# Altium schematic sheet USBSerial.SchDoc: USB Serial interface
size A4; SheetNumber: 7; SheetTotal: 7
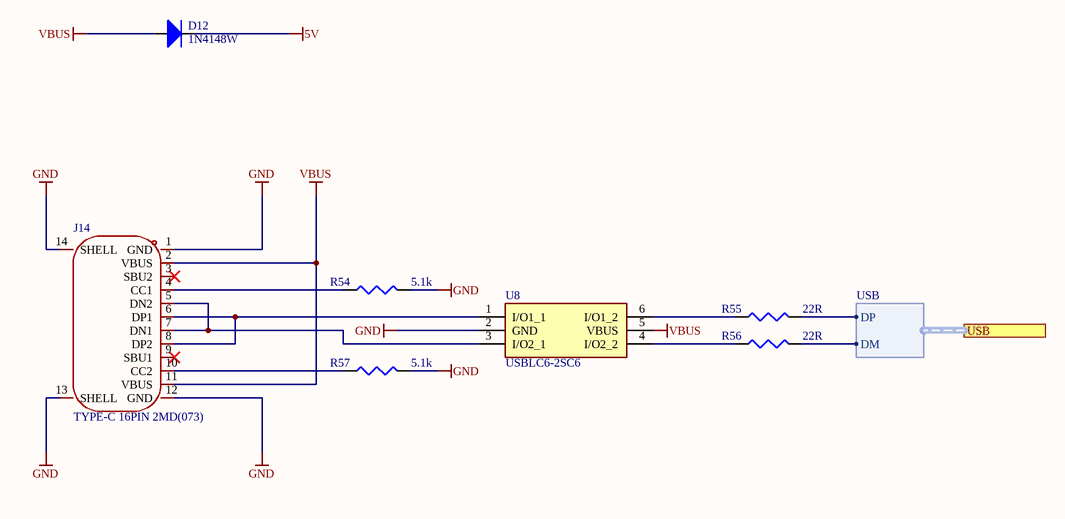
[diagram p0: USBSerial.SchDoc]

## Parts
D12  1N4148W  [SOD123]
J14  TYPE-C 16PIN 2MD(073)  [USB-C-SMD_TYPE-C-6PIN-2MD-073]
R54  5.1k  [0402]
R55  22R  [0402]
R56  22R  [0402]
R57  5.1k  [0402]
U8  USBLC6-2SC6  [SOT95P280X145-6N]

## Ports
USB (harness USB)

## Harnesses
USB: DM, DP

## Nets
5V: D12.2(K)
GND: J14.1(GND) J14.12(GND) J14.13(SHELL) J14.14(SHELL) R54.2 R57.2 U8.2(GND)
VBUS: D12.1(A) J14.2(VBUS) J14.11(VBUS) U8.5(VBUS)
NetJ14_4: J14.4(CC1) R54.1
NetJ14_5: J14.5(DN2) J14.7(DN1) U8.3(I/O2_1)
NetJ14_6: J14.6(DP1) J14.8(DP2) U8.1(I/O1_1)
NetJ14_10: J14.10(CC2) R57.1
NetR55_1: R55.1 U8.6(I/O1_2)
NetR55_2: R55.2 ; port USB.DP
NetR56_1: R56.1 U8.4(I/O2_2)
NetR56_2: R56.2 ; port USB.DM

Not connected (* = marked no-connect by the designer): J14 3(SBU2)* 9(SBU1)*

## Notes on the sheet
- Title
- Size:
- Date:
- A4
- Number:
- Time:
- Revision:
- Sheet
- of
- File:

## Library data of the parts
D12 = MMSD4148T1G: Diode, Vrrm: 100V, If: 0.15A, Vf: 1V; Brand: ON SEMICONDUCTOR; Case Style: SOD-123; Forward Current: 0.2A; Price: 0,19; Brand Number: MMSD4148T1G; Order Code Supplier: 9556079; Supplier: Farnell; Temperature Range: -65°C to +150°C; Vrrm: 100V; Forward Voltage: 1V
J14 = TYPE-C 16PIN 2MD(073): Manufacturer: SHOU HAN(首韩); Add into BOM: yes; Gender: 母; Number of Contacts: 16P; Number of Ports: 1; Current Rating - Power (Max): 5A; Rated Voltage (Max): 5V; Connect-Disconnect Life: 5千次; Core Colour: 黑色; Symbol: TYPE-C 16PIN 2MD(073); Device: TYPE-C 16PIN 2MD(073); LCSC Part Name: Type-C 母 卧贴; Supplier Part: C2765186; Manufacturer Part: TYPE-C 16PIN 2MD(073); Supplier Footprint: SMD; Datasheet: https://atta.szlcsc.com/upload/public/pdf/source/20211123/39B17C16241EAC15C5E277BDA434118E.pdf; Supplier: LCSC; Convert to PCB: yes; Connector Type: Type-C; Standard: USB 3.1; Mounting Style: 卧贴; Operating Temperature Range: -25℃~+85℃
R54-R57 = 240/0402/0063W/50V: Resistor, 240, 0.1%, 0.0625W, 50V, 100PPM, 0402; Brand: VISHAY DRALORIC; Brand Number: CRCW0402240RFKED; Power Rating: 0.063W; Resistance: 240; Case Style: 0402; Order Code Supplier: 2121522; Price: 0,0006; Supplier: Farnell; Temperature Coefficient: ± 100PPM; Temperature Range: -55°C to +125°C; Voltage Rating: 50V
U8 = USBLC6-2SC6: Integrated Circuit; Manufacturer_Name: STMicroelectronics; Datasheet Link: http://www.st.com/st-web-ui/static/active/en/resource/technical/document/datasheet/CD00050750.pdf; Height: 1.45mm; Manufacturer_Part_Number: USBLC6-2SC6; Mouser Part Number: 511-USBLC6-2SC6; Mouser Price/Stock: https://www.mouser.co.uk/ProductDetail/STMicroelectronics/USBLC6-2SC6?qs=po45yt2pPpu%2FhNIlwQdTlg%3D%3D; Arrow Part Number: USBLC6-2SC6; Arrow Price/Stock: https://www.arrow.com/en/products/usblc6-2sc6/stmicroelectronics?utm_currency=USD&region=europe